# Altium project PCB_Project1.PrjPCB
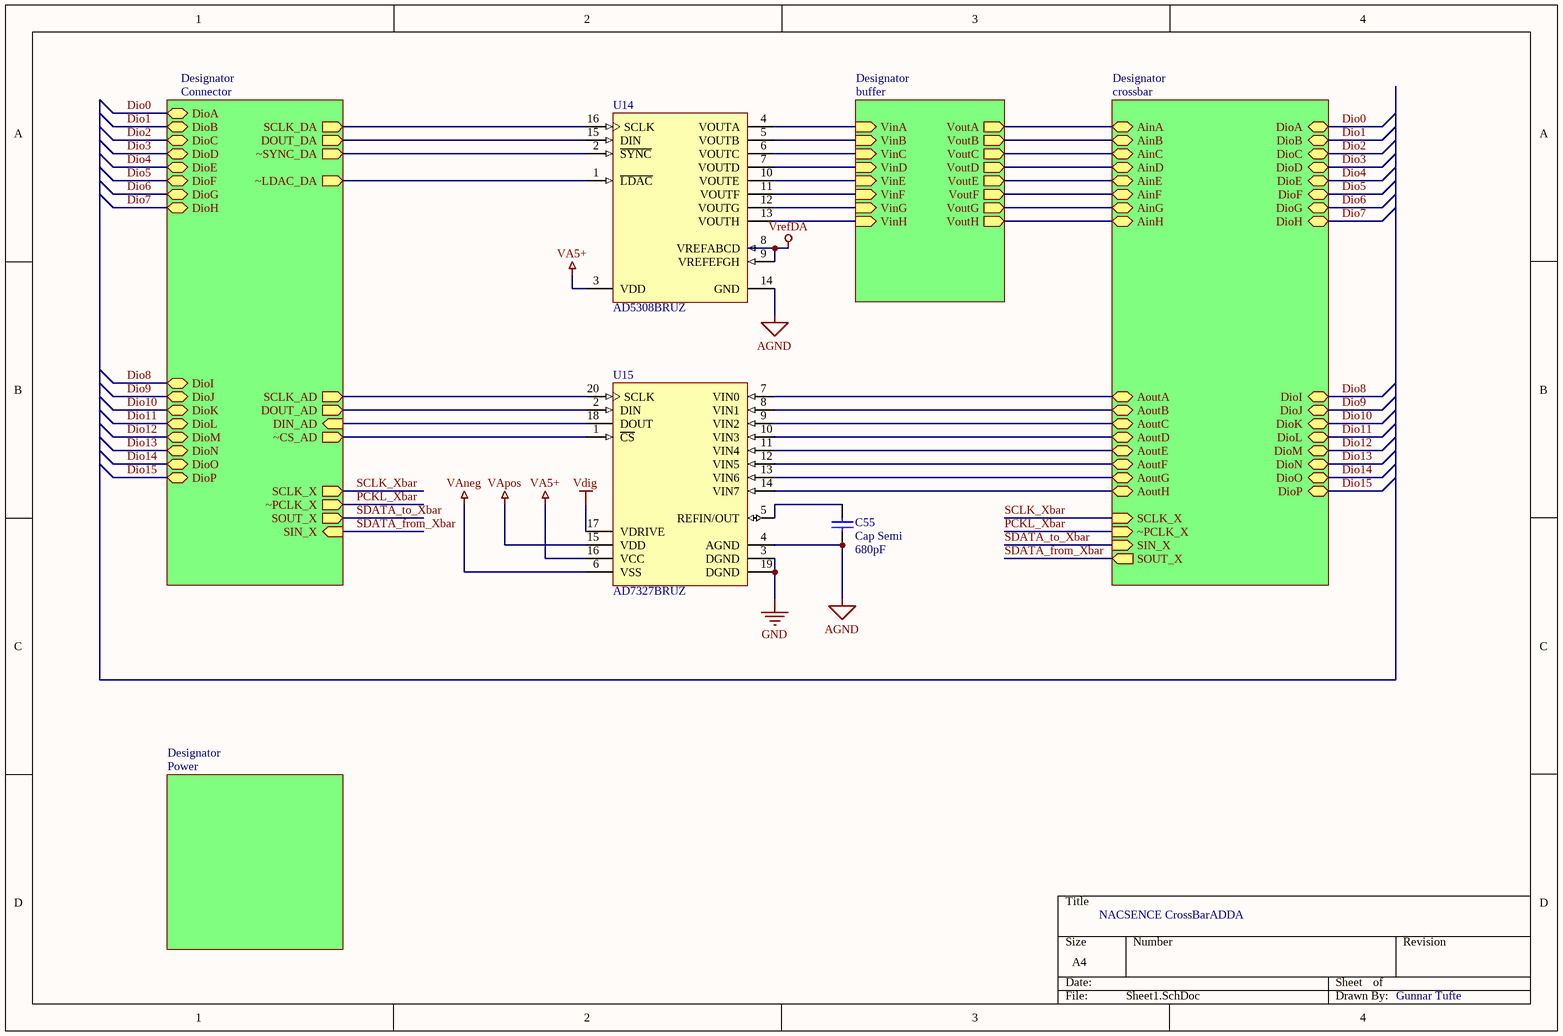
[diagram p0: Sheet1.SchDoc]
5 sheets, 117 parts. Net scope: hierarchical (ports join the sheet entries above them; power ports are global).
Board file: crossBarAdDaPCB1.PcbDoc
Sheets:
  Sheet1.SchDoc
    Designator = buffer.SchDoc
    Designator = crossbar.SchDoc
    Designator = Connector.SchDoc
    Designator = Power.SchDoc

## Sheet Sheet1.SchDoc
size A4

### Parts
C55  Cap Semi  value 680pF  [C1206]
U14  AD5308BRUZ  [RU-16_N]
U15  AD7327BRUZ  [RU-20_N]

### Sub-sheets
Designator = buffer: VinA (in), VinB (in), VinC (in), VinD (in), VinE (in), VinF (in), VinG (in), VinH (in), VoutA (out), VoutB (out), VoutC (out), VoutD (out), VoutE (out), VoutF (out), VoutG (out), VoutH (out)
Designator = crossbar: AinA, AinB, AinD, AinC, AinE, AinF, AinG, AinH, AoutA, AoutB, AoutD, AoutC, AoutE, AoutF, AoutG, AoutH, DioA, DioB, DioC, DioD, DioE, DioG, DioF, DioH, DioI, DioJ, DioK, DioL, DioM, DioN, DioO, DioP, SOUT_X (out), SIN_X (in), ~PCLK_X (in), SCLK_X (in)
Designator = Connector: SCLK_DA (out), DOUT_DA (out), ~SYNC_DA (out), ~LDAC_DA (out), SCLK_AD (out), DOUT_AD (out), DIN_AD (in), ~CS_AD (out), SCLK_X (out), ~PCLK_X (out), SOUT_X (out), SIN_X (in), DioA, DioB, DioC, DioD, DioE, DioG, DioF, DioH, DioI, DioJ, DioK, DioL, DioM, DioN, DioO, DioP
Designator = Power: no entries

### Nets
AGND: C55.2 U14.14(GND) U15.4(AGND)
GND: U15.3(DGND) U15.19(DGND)
VA5+: U14.3(VDD) U15.16(VCC)
VAneg: U15.6(VSS)
VApos: U15.15(VDD)
Vdig: U15.17(VDRIVE)
VrefDA: U14.8(VREFABCD) U14.9(VREFEFGH)
Dio0: sheet Designator/DioA, sheet Designator/DioA
Dio1: sheet Designator/DioB, sheet Designator/DioB
Dio2: sheet Designator/DioC, sheet Designator/DioC
Dio3: sheet Designator/DioD, sheet Designator/DioD
Dio4: sheet Designator/DioE, sheet Designator/DioE
Dio5: sheet Designator/DioF, sheet Designator/DioF
Dio6: sheet Designator/DioG, sheet Designator/DioG
Dio7: sheet Designator/DioH, sheet Designator/DioH
Dio8: sheet Designator/DioI, sheet Designator/DioI
Dio9: sheet Designator/DioJ, sheet Designator/DioJ
Dio10: sheet Designator/DioK, sheet Designator/DioK
Dio11: sheet Designator/DioL, sheet Designator/DioL
Dio12: sheet Designator/DioM, sheet Designator/DioM
Dio13: sheet Designator/DioN, sheet Designator/DioN
Dio14: sheet Designator/DioO, sheet Designator/DioO
Dio15: sheet Designator/DioP, sheet Designator/DioP
PCKL_Xbar: sheet Designator/~PCLK_X, sheet Designator/~PCLK_X
SCLK_Xbar: sheet Designator/SCLK_X, sheet Designator/SCLK_X
SDATA_from_Xbar: sheet Designator/SOUT_X, sheet Designator/SIN_X
SDATA_to_Xbar: sheet Designator/SIN_X, sheet Designator/SOUT_X
Net*1_15: sheet Designator/VoutA, sheet Designator/AinA
Net*1_16: sheet Designator/VoutB, sheet Designator/AinB
Net*1_17: sheet Designator/VoutC, sheet Designator/AinC
Net*1_18: sheet Designator/VoutD, sheet Designator/AinD
Net*1_19: sheet Designator/VoutE, sheet Designator/AinE
Net*1_20: sheet Designator/VoutF, sheet Designator/AinF
Net*1_21: sheet Designator/VoutG, sheet Designator/AinG
Net*1_22: sheet Designator/VoutH, sheet Designator/AinH
Net*1_23: U15.7(VIN0) ; sheet Designator/AoutA
Net*1_24: U15.8(VIN1) ; sheet Designator/AoutB
Net*1_25: U15.9(VIN2) ; sheet Designator/AoutC
Net*1_26: U15.10(VIN3) ; sheet Designator/AoutD
Net*1_27: U15.11(VIN4) ; sheet Designator/AoutE
Net*1_28: U15.12(VIN5) ; sheet Designator/AoutF
Net*1_29: U15.13(VIN6) ; sheet Designator/AoutG
Net*1_30: U15.14(VIN7) ; sheet Designator/AoutH
NetC55_1: C55.1 U15.5(REFIN/OUT)
NetP2_2: U14.15(DIN) ; sheet Designator/DOUT_DA
NetP4_2: U14.2(~{SYNC}) ; sheet Designator/~SYNC_DA
NetP6_2: U14.1(~{LDAC}) ; sheet Designator/~LDAC_DA
NetP7_2: U15.2(DIN) ; sheet Designator/DOUT_AD
NetP8_2: U15.18(DOUT) ; sheet Designator/DIN_AD
NetP9_2: U15.1(~{CS}) ; sheet Designator/~CS_AD
NetPnorth1_2: U14.16(SCLK) ; sheet Designator/SCLK_DA
NetPnorth1_4: U15.20(SCLK) ; sheet Designator/SCLK_AD
NetU1_3: U14.4(VOUTA) ; sheet Designator/VinA
NetU2_3: U14.10(VOUTE) ; sheet Designator/VinE
NetU3_3: U14.5(VOUTB) ; sheet Designator/VinB
NetU4_3: U14.11(VOUTF) ; sheet Designator/VinF
NetU5_3: U14.6(VOUTC) ; sheet Designator/VinC
NetU6_3: U14.12(VOUTG) ; sheet Designator/VinG
NetU7_3: U14.7(VOUTD) ; sheet Designator/VinD
NetU8_3: U14.13(VOUTH) ; sheet Designator/VinH

### Notes on the sheet
- NACSENCE CrossBarADDA
- Gunnar Tufte

### Library data of the parts
C55 = Cap Semi: Capacitor (Semiconductor SIM Model); Published: 8-Jun-2000; LatestRevisionDate: 29-May-2009; LatestRevisionNote: IPC-7351 Footprint Added.; PackageReference: C1206; Publisher: Altium Limited; PackageDescription: Chip Capacitor
U14 = AD5308BRUZ: Octal 8-Bit Voltage Output Digital-to-Analog Converter, 2.5 to 5.5 V, -40 to +125 degC, RU-16, Pb-Free, Tube; ADI Part Number: AD5308; Manufacturer: Analog Devices; # DAC Outputs: 8; Max V+: 5.5V; Op Pwr Diss: 5mW; Settling Time: 6µs; Single Supply: Yes; DatasheetVersion: Rev.F; PackageVersion: Nov-2002; PackageReference: RU-16; PackageDescription: 16-Lead Thin Shrink Small Outline Package [TSSOP]; Packing: Tube; Resolution (Bits): 8; RoHS: Y; Mounting Technology: Surface Mount; Code_JEDEC: MO-153-AB; ComponentLink1Description: Manufacturer URL; ComponentLink1URL: http://www.analog.com/en/index.html; ComponentLink2Description: Datasheet; ComponentLink2URL: http://www.analog.com/static/imported-files/data_sheets/AD5308_5318_5328.pdf; ComponentLink3Description: Package Specification; ComponentLink3URL: http://www.analog.com/static/imported-files/packages/36244347913743854010197452789RU16.pdf; ComponentLink4Description: URL Link1; ComponentLink4URL: Product URL:http://www.analog.com/en/digital-to-analog-converters/da-converters/ad5308/products/product.html
U15 = AD7327BRUZ: Octal 12-Bit True Bipolar Input Plus Sign Analog-to-Digital Converter with Serial, SPI Interface, Software-Selectable, 500KSPS, -40 to +85 degC, RU-20, Pb-Free, Tube; Part Number: AD7327; Manufacturer: Analog Devices; Resolution (Bits): 13; Channels: 8; Throughput Rate (SPS): 500K; Interface: Ser, SPI; DatasheetVersion: Rev.A; PackageVersion: 2000; PackageReference: RU-20; PackageDescription: 20-Lead Thin Shrink Small Outline Package [TSSOP]; RoHS: Y; Packing: Tube; Mounting Technology: Surface Mount; Code_JEDEC: MO-153AC; ComponentLink1Description: Manufacturer URL; ComponentLink1URL: http://www.analog.com/en/index.html; ComponentLink2Description: Datasheet; ComponentLink2URL: http://www.analog.com/static/imported-files/data_sheets/AD7327.pdf; ComponentLink3Description: Package Specification; ComponentLink3URL: http://www.analog.com/static/imported-files/packages/364515793657813558433715854054607941441RU20.pdf; ComponentLink4Description: Product URL; ComponentLink4URL: http://www.analog.com/en/analog-to-digital-converters/ad-converters/ad7327/products/product.html

## Sheet buffer.SchDoc
size A4
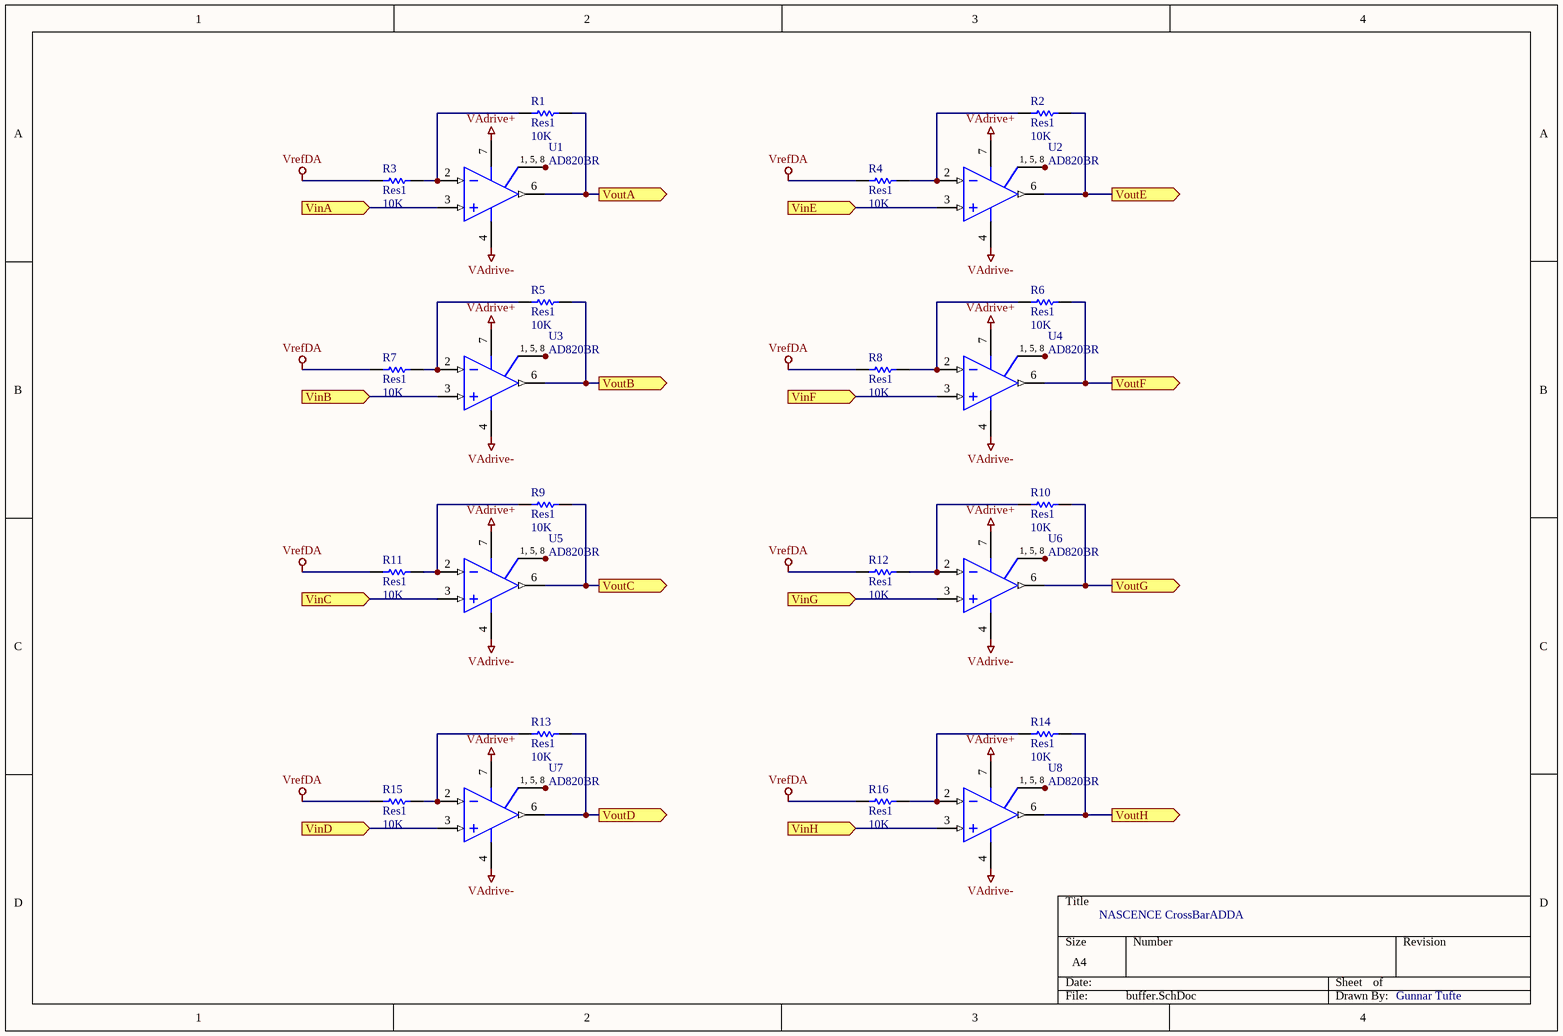
[diagram p1: buffer.SchDoc]

### Parts
R1  Res1  value 10K  [AXIAL-0.3]
R2  Res1  value 10K  [AXIAL-0.3]
R3  Res1  value 10K  [AXIAL-0.3]
R4  Res1  value 10K  [AXIAL-0.3]
R5  Res1  value 10K  [AXIAL-0.3]
R6  Res1  value 10K  [AXIAL-0.3]
R7  Res1  value 10K  [AXIAL-0.3]
R8  Res1  value 10K  [AXIAL-0.3]
R9  Res1  value 10K  [AXIAL-0.3]
R10  Res1  value 10K  [AXIAL-0.3]
R11  Res1  value 10K  [AXIAL-0.3]
R12  Res1  value 10K  [AXIAL-0.3]
R13  Res1  value 10K  [AXIAL-0.3]
R14  Res1  value 10K  [AXIAL-0.3]
R15  Res1  value 10K  [AXIAL-0.3]
R16  Res1  value 10K  [AXIAL-0.3]
U1  AD820BR  [R-8D_N]
U2  AD820BR  [R-8D_N]
U3  AD820BR  [R-8D_N]
U4  AD820BR  [R-8D_N]
U5  AD820BR  [R-8D_N]
U6  AD820BR  [R-8D_N]
U7  AD820BR  [R-8D_N]
U8  AD820BR  [R-8D_N]

### Ports
VinA (in), VinB (in), VinC (in), VinD (in), VinE (in), VinF (in), VinG (in), VinH (in), VoutA (out), VoutB (out), VoutC (out), VoutD (out), VoutE (out), VoutF (out), VoutG (out), VoutH (out)

### Nets
VAdrive+: U1.7(V+) U2.7(V+) U3.7(V+) U4.7(V+) U5.7(V+) U6.7(V+) U7.7(V+) U8.7(V+)
VAdrive-: U1.4(V-) U2.4(V-) U3.4(V-) U4.4(V-) U5.4(V-) U6.4(V-) U7.4(V-) U8.4(V-)
VrefDA: R3.1 R4.1 R7.1 R8.1 R11.1 R12.1 R15.1 R16.1
Net*1_15: R1.2 U1.6(OUT) ; port VoutA
Net*1_16: R5.2 U3.6(OUT) ; port VoutB
Net*1_17: R9.2 U5.6(OUT) ; port VoutC
Net*1_18: R13.2 U7.6(OUT) ; port VoutD
Net*1_19: R2.2 U2.6(OUT) ; port VoutE
Net*1_20: R6.2 U4.6(OUT) ; port VoutF
Net*1_21: R10.2 U6.6(OUT) ; port VoutG
Net*1_22: R14.2 U8.6(OUT) ; port VoutH
NetR1_1: R1.1 R3.2 U1.2(IN-)
NetR2_1: R2.1 R4.2 U2.2(IN-)
NetR5_1: R5.1 R7.2 U3.2(IN-)
NetR6_1: R6.1 R8.2 U4.2(IN-)
NetR9_1: R9.1 R11.2 U5.2(IN-)
NetR10_1: R10.1 R12.2 U6.2(IN-)
NetR13_1: R13.1 R15.2 U7.2(IN-)
NetR14_1: R14.1 R16.2 U8.2(IN-)
NetU1_1: U1.1(NC) U1.5(NC) U1.8(NC)
NetU1_3: U1.3(IN+) ; port VinA
NetU2_1: U2.1(NC) U2.5(NC) U2.8(NC)
NetU2_3: U2.3(IN+) ; port VinE
NetU3_1: U3.1(NC) U3.5(NC) U3.8(NC)
NetU3_3: U3.3(IN+) ; port VinB
NetU4_1: U4.1(NC) U4.5(NC) U4.8(NC)
NetU4_3: U4.3(IN+) ; port VinF
NetU5_1: U5.1(NC) U5.5(NC) U5.8(NC)
NetU5_3: U5.3(IN+) ; port VinC
NetU6_1: U6.1(NC) U6.5(NC) U6.8(NC)
NetU6_3: U6.3(IN+) ; port VinG
NetU7_1: U7.1(NC) U7.5(NC) U7.8(NC)
NetU7_3: U7.3(IN+) ; port VinD
NetU8_1: U8.1(NC) U8.5(NC) U8.8(NC)
NetU8_3: U8.3(IN+) ; port VinH

### Notes on the sheet
- NASCENCE CrossBarADDA
- Gunnar Tufte
- (in symbol AD820BR) 1, 5, 8

### Library data of the parts
R1-R16 = Res1: Resistor; Published: 8-Jun-2000; LatestRevisionDate: 17-Jul-2002; LatestRevisionNote: Re-released for DXP Platform.; PackageReference: AXIAL-0.3; Publisher: Altium Limited; PackageDescription: Axial Device, Thru-Hole; 2 Leads; 0.3 in Pin Spacing
U1-U8 = AD820BR: Single-Supply, Rail-to-Rail Low-Power FET-Input Operational Amplifier; Note: Pins 1, 5 and 8 are not connected.; Published: 8-Jun-2000; LatestRevisionDate: 13-Apr-2006; LatestRevisionNote: IPC-7351 Footprint Added.; DatasheetVersion: REV. A; PackageVersion: 1998; PackageReference: R-8D; Publisher: Altium Limited; PackageDescription: 8-Pin Narrow Body Small Outline Integrated Circuit 1.27 mm Pitch; ComponentLink1Description: Manufacturer Link; ComponentLink1URL: http://www.analog.com/en/prod/0,,759_786_AD820%2C00.html; ComponentLink2Description: Datasheet; ComponentLink2URL: http://www.analog.com/UploadedFiles/Data_Sheets/446075391AD820_d.pdf

## Sheet crossbar.SchDoc: CrossBar AD/DA
size A4; CompanyName: NTNU; DrawnBy: Gunnar Tufte; ProjectName: NASCENCE
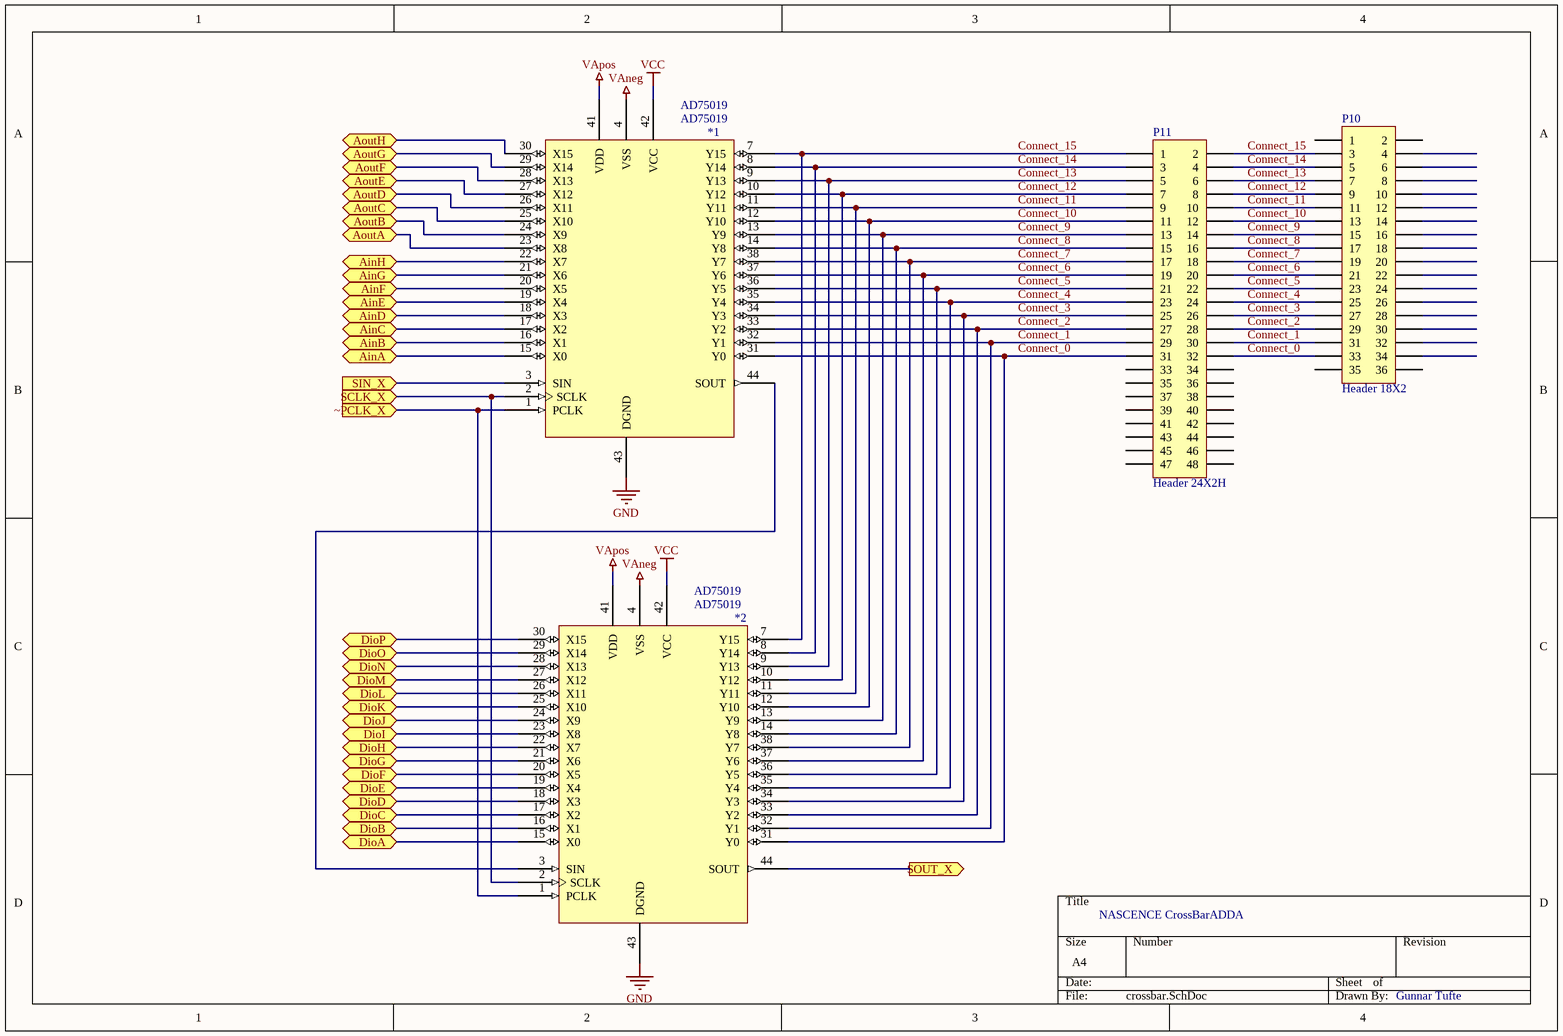
[diagram p2: crossbar.SchDoc]

### Parts
*1  AD75019  [PLCC-44AL]
*2  AD75019  [PLCC-44AL]
P10  Header 18X2  [HDR2X18]
P11  Header 24X2H  [HDR2X24H]

### Ports
AinA, AinB, AinC, AinD, AinE, AinF, AinG, AinH, AoutA, AoutB, AoutC, AoutD, AoutE, AoutF, AoutG, AoutH, DioA, DioB, DioC, DioD, DioE, DioF, DioG, DioH, DioI, DioJ, DioK, DioL, DioM, DioN, DioO, DioP, SCLK_X (in), SIN_X (in), SOUT_X (out), ~PCLK_X (in)

### Nets
GND: *1.43(DGND) *2.43(DGND)
VAneg: *1.4(VSS) *2.4(VSS)
VApos: *1.41(VDD) *2.41(VDD)
VCC: *1.42(VCC) *2.42(VCC)
Connect_0: *1.31(Y0) *2.31(Y0) P10.33 P11.31 P11.32
Connect_1: *1.32(Y1) *2.32(Y1) P10.31 P11.29 P11.30
Connect_2: *1.33(Y2) *2.33(Y2) P10.29 P11.27 P11.28
Connect_3: *1.34(Y3) *2.34(Y3) P10.27 P11.25 P11.26
Connect_4: *1.35(Y4) *2.35(Y4) P10.25 P11.23 P11.24
Connect_5: *1.36(Y5) *2.36(Y5) P10.23 P11.21 P11.22
Connect_6: *1.37(Y6) *2.37(Y6) P10.21 P11.19 P11.20
Connect_7: *1.38(Y7) *2.38(Y7) P10.19 P11.17 P11.18
Connect_8: *1.14(Y8) *2.14(Y8) P10.17 P11.15 P11.16
Connect_9: *1.13(Y9) *2.13(Y9) P10.15 P11.13 P11.14
Connect_10: *1.12(Y10) *2.12(Y10) P10.13 P11.11 P11.12
Connect_11: *1.11(Y11) *2.11(Y11) P10.11 P11.9 P11.10
Connect_12: *1.10(Y12) *2.10(Y12) P10.9 P11.7 P11.8
Connect_13: *1.9(Y13) *2.9(Y13) P10.7 P11.5 P11.6
Connect_14: *1.8(Y14) *2.8(Y14) P10.5 P11.3 P11.4
Connect_15: *1.7(Y15) *2.7(Y15) P10.3 P11.1 P11.2
Dio0: *2.15(X0) ; port DioA
Dio1: *2.16(X1) ; port DioB
Dio2: *2.17(X2) ; port DioC
Dio3: *2.18(X3) ; port DioD
Dio4: *2.19(X4) ; port DioE
Dio5: *2.20(X5) ; port DioF
Dio6: *2.21(X6) ; port DioG
Dio7: *2.22(X7) ; port DioH
Dio8: *2.23(X8) ; port DioI
Dio9: *2.24(X9) ; port DioJ
Dio10: *2.25(X10) ; port DioK
Dio11: *2.26(X11) ; port DioL
Dio12: *2.27(X12) ; port DioM
Dio13: *2.28(X13) ; port DioN
Dio14: *2.29(X14) ; port DioO
Dio15: *2.30(X15) ; port DioP
PCKL_Xbar: *1.1(PCLK) *2.1(PCLK) ; port ~PCLK_X
SCLK_Xbar: *1.2(SCLK) *2.2(SCLK) ; port SCLK_X
SDATA_from_Xbar: *2.44(SOUT) ; port SOUT_X
SDATA_to_Xbar: *1.3(SIN) ; port SIN_X
Net*1_15: *1.15(X0) ; port AinA
Net*1_16: *1.16(X1) ; port AinB
Net*1_17: *1.17(X2) ; port AinC
Net*1_18: *1.18(X3) ; port AinD
Net*1_19: *1.19(X4) ; port AinE
Net*1_20: *1.20(X5) ; port AinF
Net*1_21: *1.21(X6) ; port AinG
Net*1_22: *1.22(X7) ; port AinH
Net*1_23: *1.23(X8) ; port AoutA
Net*1_24: *1.24(X9) ; port AoutB
Net*1_25: *1.25(X10) ; port AoutC
Net*1_26: *1.26(X11) ; port AoutD
Net*1_27: *1.27(X12) ; port AoutE
Net*1_28: *1.28(X13) ; port AoutF
Net*1_29: *1.29(X14) ; port AoutG
Net*1_30: *1.30(X15) ; port AoutH
Net*1_44: *1.44(SOUT) *2.3(SIN)

Not connected (* = marked no-connect by the designer): *1 5(NC1) 6(NC2) 39(NC3) 40(NC4); *2 5(NC1) 6(NC2) 39(NC3) 40(NC4); P10 1 2 4 6 8 10 12 14 16 18 20 22 24 26 28 30 32 34 35 36; P11 33 34 35 36 37 38 39 40 41 42 43 44 45 46 47 48

### Notes on the sheet
- NASCENCE CrossBarADDA
- Gunnar Tufte

### Library data of the parts
*1 *2 = Component_1: crosspoint 16x16
P10 = Header 18X2: Header, 18-Pin, Dual row; LatestRevisionDate: 17-Jul-2002; LatestRevisionNote: Re-released for DXP Platform.; Publisher: Altium Limited
P11 = Header 24X2H: Header, 24-Pin, Dual row, Right Angle; LatestRevisionDate: 17-Jul-2002; LatestRevisionNote: Re-released for DXP Platform.; Publisher: Altium Limited

## Sheet Connector.SchDoc
size A4
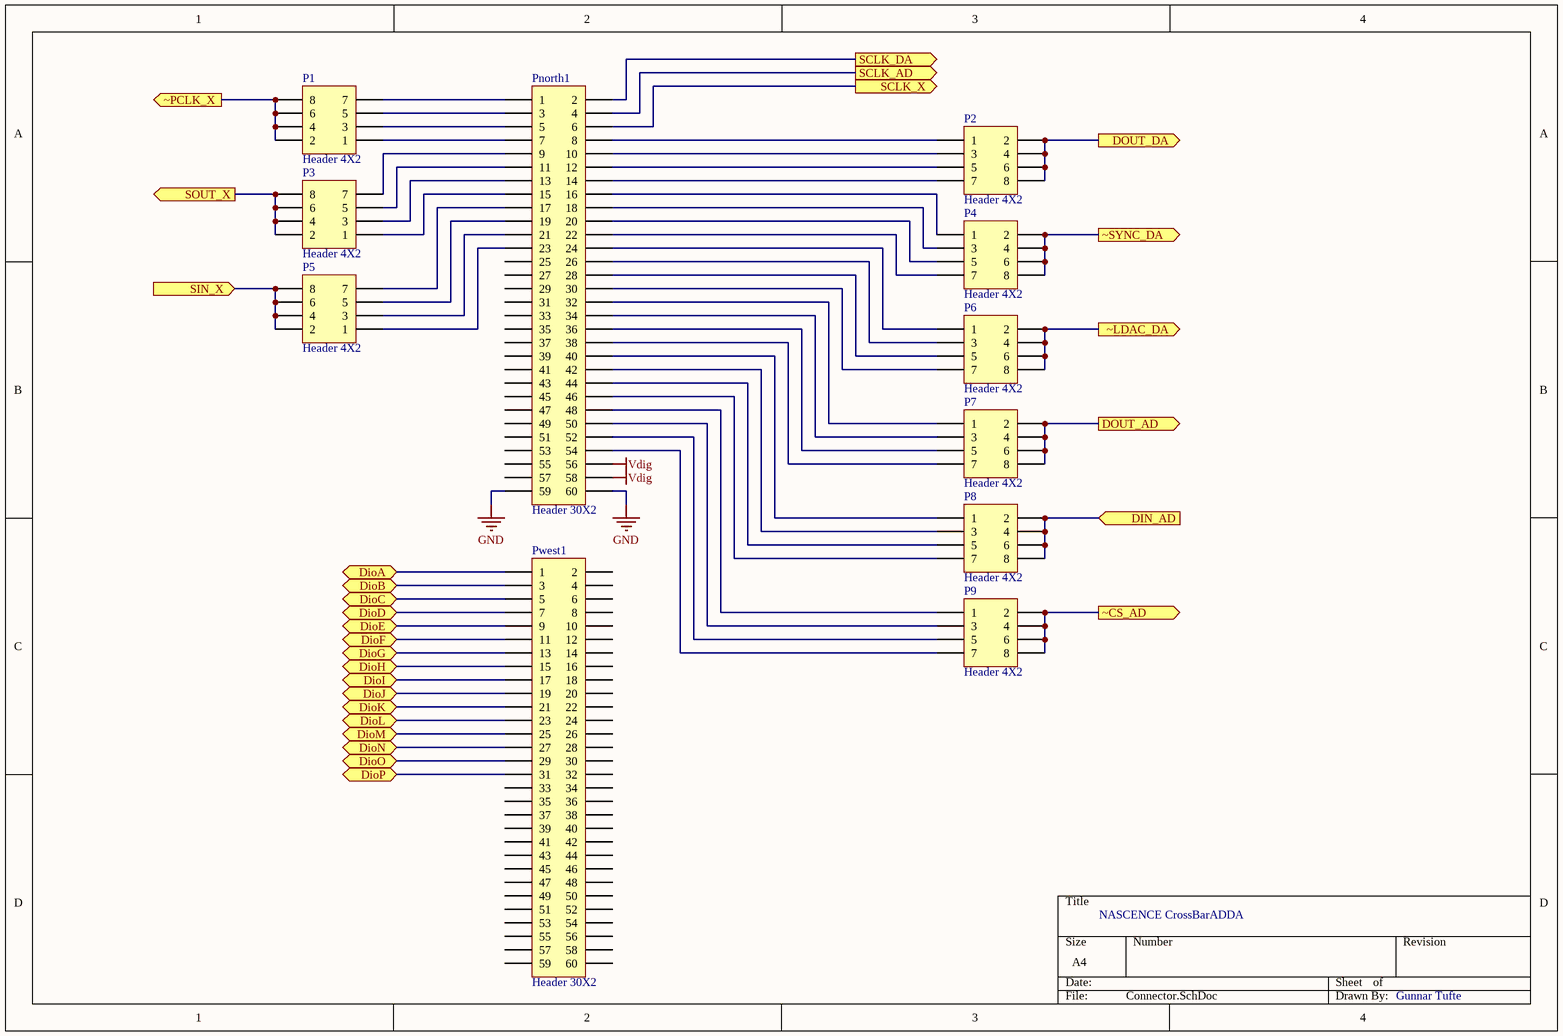
[diagram p3: Connector.SchDoc]

### Parts
P1  Header 4X2  [HDR2X4]
P2  Header 4X2  [HDR2X4]
P3  Header 4X2  [HDR2X4]
P4  Header 4X2  [HDR2X4]
P5  Header 4X2  [HDR2X4]
P6  Header 4X2  [HDR2X4]
P7  Header 4X2  [HDR2X4]
P8  Header 4X2  [HDR2X4]
P9  Header 4X2  [HDR2X4]
Pnorth1  Header 30X2  [HDR2X30]
Pwest1  Header 30X2  [HDR2X30]

### Ports
DIN_AD (in), DioA, DioB, DioC, DioD, DioE, DioF, DioG, DioH, DioI, DioJ, DioK, DioL, DioM, DioN, DioO, DioP, DOUT_AD (out), DOUT_DA (out), SCLK_AD (out), SCLK_DA (out), SCLK_X (out), SIN_X (in), SOUT_X (out), ~CS_AD (out), ~LDAC_DA (out), ~PCLK_X (out), ~SYNC_DA (out)

### Nets
GND: Pnorth1.59 Pnorth1.60
Vdig: Pnorth1.56 Pnorth1.58
Dio0: Pwest1.1 ; port DioA
Dio1: Pwest1.3 ; port DioB
Dio2: Pwest1.5 ; port DioC
Dio3: Pwest1.7 ; port DioD
Dio4: Pwest1.9 ; port DioE
Dio5: Pwest1.11 ; port DioF
Dio6: Pwest1.13 ; port DioG
Dio7: Pwest1.15 ; port DioH
Dio8: Pwest1.17 ; port DioI
Dio9: Pwest1.19 ; port DioJ
Dio10: Pwest1.21 ; port DioK
Dio11: Pwest1.23 ; port DioL
Dio12: Pwest1.25 ; port DioM
Dio13: Pwest1.27 ; port DioN
Dio14: Pwest1.29 ; port DioO
Dio15: Pwest1.31 ; port DioP
PCKL_Xbar: P1.2 P1.4 P1.6 P1.8 ; port ~PCLK_X
SCLK_Xbar: Pnorth1.6 ; port SCLK_X
SDATA_from_Xbar: P5.2 P5.4 P5.6 P5.8 ; port SIN_X
SDATA_to_Xbar: P3.2 P3.4 P3.6 P3.8 ; port SOUT_X
NetP1_1: P1.1 Pnorth1.7
NetP1_3: P1.3 Pnorth1.5
NetP1_5: P1.5 Pnorth1.3
NetP1_7: P1.7 Pnorth1.1
NetP2_1: P2.1 Pnorth1.8
NetP2_2: P2.2 P2.4 P2.6 P2.8 ; port DOUT_DA
NetP2_3: P2.3 Pnorth1.10
NetP2_5: P2.5 Pnorth1.12
NetP2_7: P2.7 Pnorth1.14
NetP3_1: P3.1 Pnorth1.15
NetP3_3: P3.3 Pnorth1.13
NetP3_5: P3.5 Pnorth1.11
NetP3_7: P3.7 Pnorth1.9
NetP4_1: P4.1 Pnorth1.16
NetP4_2: P4.2 P4.4 P4.6 P4.8 ; port ~SYNC_DA
NetP4_3: P4.3 Pnorth1.18
NetP4_5: P4.5 Pnorth1.20
NetP4_7: P4.7 Pnorth1.22
NetP5_1: P5.1 Pnorth1.23
NetP5_3: P5.3 Pnorth1.21
NetP5_5: P5.5 Pnorth1.19
NetP5_7: P5.7 Pnorth1.17
NetP6_1: P6.1 Pnorth1.24
NetP6_2: P6.2 P6.4 P6.6 P6.8 ; port ~LDAC_DA
NetP6_3: P6.3 Pnorth1.26
NetP6_5: P6.5 Pnorth1.28
NetP6_7: P6.7 Pnorth1.30
NetP7_1: P7.1 Pnorth1.32
NetP7_2: P7.2 P7.4 P7.6 P7.8 ; port DOUT_AD
NetP7_3: P7.3 Pnorth1.34
NetP7_5: P7.5 Pnorth1.36
NetP7_7: P7.7 Pnorth1.38
NetP8_1: P8.1 Pnorth1.40
NetP8_2: P8.2 P8.4 P8.6 P8.8 ; port DIN_AD
NetP8_3: P8.3 Pnorth1.42
NetP8_5: P8.5 Pnorth1.44
NetP8_7: P8.7 Pnorth1.46
NetP9_1: P9.1 Pnorth1.48
NetP9_2: P9.2 P9.4 P9.6 P9.8 ; port ~CS_AD
NetP9_3: P9.3 Pnorth1.50
NetP9_5: P9.5 Pnorth1.52
NetP9_7: P9.7 Pnorth1.54
NetPnorth1_2: Pnorth1.2 ; port SCLK_DA
NetPnorth1_4: Pnorth1.4 ; port SCLK_AD

Not connected (* = marked no-connect by the designer): Pnorth1 25 27 29 31 33 35 37 39 41 43 45 47 49 51 53 55 57; Pwest1 2 4 6 8 10 12 14 16 18 20 22 24 26 28 30 32 33 34 35 36 37 38 39 40 41 42 43 44 45 46 47 48 49 50 51 52 53 54 55 56 57 58 59 60

### Notes on the sheet
- NASCENCE CrossBarADDA
- Gunnar Tufte

### Library data of the parts
P1-P9 = Header 4X2: Header, 4-Pin, Dual row; LatestRevisionDate: 17-Jul-2002; LatestRevisionNote: Re-released for DXP Platform.; Publisher: Altium Limited
Pnorth1 Pwest1 = Header 30X2: Header, 30-Pin, Dual row; LatestRevisionDate: 17-Jul-2002; LatestRevisionNote: Re-released for DXP Platform.; Publisher: Altium Limited

## Sheet Power.SchDoc
size A4; CompanyName: NTNU; DrawnBy: GT
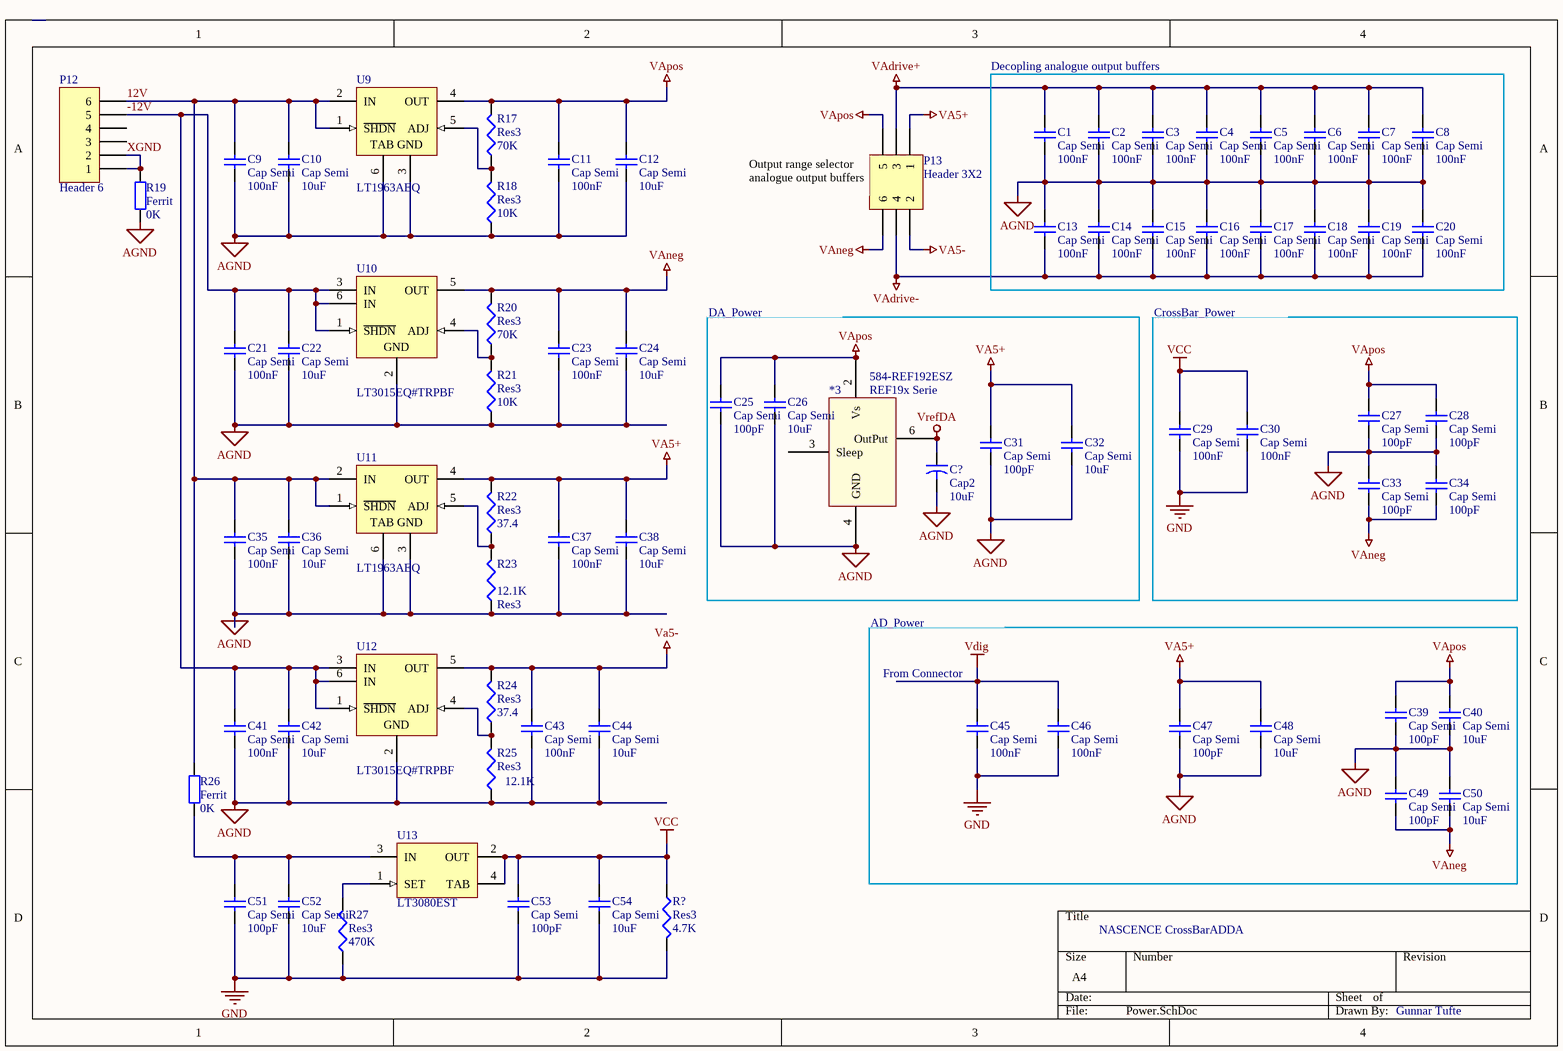
[diagram p4: Power.SchDoc]

### Parts
*3  REF19x Serie  Supplier Part Number 1: 584-REF192ESZ  [SOIC127P600-8M]
C1  Cap Semi  value 100nF  [C1206]
C2  Cap Semi  value 100nF  [C1206]
C3  Cap Semi  value 100nF  [C1206]
C4  Cap Semi  value 100nF  [C1206]
C5  Cap Semi  value 100nF  [C1206]
C6  Cap Semi  value 100nF  [C1206]
C7  Cap Semi  value 100nF  [C1206]
C8  Cap Semi  value 100nF  [C1206]
C9  Cap Semi  value 100nF  [C1206]
C10  Cap Semi  value 10uF  [C1206]
C11  Cap Semi  value 100nF  [C1206]
C12  Cap Semi  value 10uF  [C1206]
C13  Cap Semi  value 100nF  [C1206]
C14  Cap Semi  value 100nF  [C1206]
C15  Cap Semi  value 100nF  [C1206]
C16  Cap Semi  value 100nF  [C1206]
C17  Cap Semi  value 100nF  [C1206]
C18  Cap Semi  value 100nF  [C1206]
C19  Cap Semi  value 100nF  [C1206]
C20  Cap Semi  value 100nF  [C1206]
C21  Cap Semi  value 100nF  [C1206]
C22  Cap Semi  value 10uF  [C1206]
C23  Cap Semi  value 100nF  [C1206]
C24  Cap Semi  value 10uF  [C1206]
C25  Cap Semi  value 100pF  [C1206]
C26  Cap Semi  value 10uF  [C1206]
C27  Cap Semi  value 100pF  [C1206]
C28  Cap Semi  value 100pF  [C1206]
C29  Cap Semi  value 100nF  [C1206]
C30  Cap Semi  value 100nF  [C1206]
C31  Cap Semi  value 100pF  [C1206]
C32  Cap Semi  value 10uF  [C1206]
C33  Cap Semi  value 100pF  [C1206]
C34  Cap Semi  value 100pF  [C1206]
C35  Cap Semi  value 100nF  [C1206]
C36  Cap Semi  value 10uF  [C1206]
C37  Cap Semi  value 100nF  [C1206]
C38  Cap Semi  value 10uF  [C1206]
C39  Cap Semi  value 100pF  [C1206]
C40  Cap Semi  value 10uF  [C1206]
C41  Cap Semi  value 100nF  [C1206]
C42  Cap Semi  value 10uF  [C1206]
C43  Cap Semi  value 100nF  [C1206]
C44  Cap Semi  value 10uF  [C1206]
C45  Cap Semi  value 100nF  [C1206]
C46  Cap Semi  value 100nF  [C1206]
C47  Cap Semi  value 100pF  [C1206]
C48  Cap Semi  value 10uF  [C1206]
C49  Cap Semi  value 100pF  [C1206]
C50  Cap Semi  value 10uF  [C1206]
C51  Cap Semi  value 100pF  [C1206]
C52  Cap Semi  value 10uF  [C1206]
C53  Cap Semi  value 100pF  [C1206]
C54  Cap Semi  value 10uF  [C1206]
C?  Cap2  value 10uF  [CAPR5-4X5]
P12  Header 6  [HDR1X6]
P13  Header 3X2  [HDR2X3]
R17  Res3  value 70K  [14-1210]
R18  Res3  value 10K  [14-1210]
R19  Ferrit  value 0K  [AXIAL-0.4]
R20  Res3  value 70K  [14-1210]
R21  Res3  value 10K  [14-1210]
R22  Res3  value 37.4  [14-1210]
R23  Res3  value 12.1K  [14-1210]
R24  Res3  value 37.4  [14-1210]
R25  Res3  value 12.1K  [14-1210]
R26  Ferrit  value 0K  [AXIAL-0.4]
R27  Res3  value 470K  [14-1210]
R?  Res3  value 4.7K  [14-1210]
U9  LT1963AEQ  [LT-Q-5_N]
U10  LT3015EQ#TRPBF  [LT-Q-5_N]
U11  LT1963AEQ  [LT-Q-5_N]
U12  LT3015EQ#TRPBF  [LT-Q-5_N]
U13  LT3080EST  [LT-ST-3-SOT-223_N]

### Blocks framed on the sheet
Decopling analogue output buffers: C1-C8 C13-C20

### Nets
AGND: *3.4(GND) C1.2 C2.2 C3.1 C4.1 C5.1 C6.1 C7.1 C8.1 C9.1 C10.1 C11.1 C12.1 C13.2 C14.2 C15.2 C16.2 C17.2 C18.2 C19.2 C20.2 C21.1 C22.1 C23.1 C24.1 C25.1 C26.1 C27.1 C28.1 C31.1 C32.1 C33.2 C34.2 C35.1 C36.1 C37.1 C38.1 C39.1 C40.1 C41.1 C42.1 C43.1 C44.1 C47.2 C48.2 C49.2 C50.2 C?.2 R18.1 R19.1 R21.1 R23.1 R25.1 U9.3(GND) U9.6(TAB) U10.2(GND) U11.3(GND) U11.6(TAB) U12.2(GND)
GND: C29.1 C30.1 C45.1 C46.1 C51.2 C52.2 C53.2 C54.2 R27.1 R?.2
VA5+: C31.2 C32.2 C37.2 C38.2 C47.1 C48.1 P13.1 R22.2 U11.4(OUT)
VA5-: C43.2 C44.2 P13.2 R24.2 U12.5(OUT)
VAdrive+: C1.1 C2.1 C3.2 C4.2 C5.2 C6.2 C7.2 C8.2 P13.3
VAdrive-: C13.1 C14.1 C15.1 C16.1 C17.1 C18.1 C19.1 C20.1 P13.4
VAneg: C23.2 C24.2 C33.1 C34.1 C49.1 C50.1 P13.6 R20.2 U10.5(OUT)
VApos: *3.2(Vs) C11.2 C12.2 C25.2 C26.2 C27.2 C28.2 C39.2 C40.2 P13.5 R17.2 U9.4(OUT)
VCC: C29.2 C30.2 C53.1 C54.1 R?.1 U13.2(OUT) U13.4(TAB)
Vdig: C45.2 C46.2
VrefDA: *3.6(OutPut) C?.1
12V: C9.2 C10.2 C35.2 C36.2 P12.6 R26.2 U9.1(~{SHDN}) U9.2(IN) U11.1(~{SHDN}) U11.2(IN)
-12V: C21.2 C22.2 C41.2 C42.2 P12.5 U10.1(~{SHDN}) U10.3(IN) U10.6(IN) U12.1(~{SHDN}) U12.3(IN) U12.6(IN)
XGND: P12.1 P12.2 R19.2
NetC51_1: C51.1 C52.1 R26.1 U13.3(IN)
NetR17_1: R17.1 R18.2 U9.5(ADJ)
NetR20_1: R20.1 R21.2 U10.4(ADJ)
NetR22_1: R22.1 R23.2 U11.5(ADJ)
NetR24_1: R24.1 R25.2 U12.4(ADJ)
NetR27_2: R27.2 U13.1(SET)

Not connected (* = marked no-connect by the designer): *3 1(TP) 3(Sleep) 5(TP) 7(NC) 8(NC); P12 3 4

### Notes on the sheet
- (near P13) Output range selector
  analogue output buffers
- DA_Power
- CrossBar_Power
- AD_Power
- (near C45) From Connector
- NASCENCE CrossBarADDA
- Gunnar Tufte

### Library data of the parts
C1-C54 = Cap Semi: Capacitor (Semiconductor SIM Model); Published: 8-Jun-2000; LatestRevisionDate: 29-May-2009; LatestRevisionNote: IPC-7351 Footprint Added.; PackageReference: C1206; Publisher: Altium Limited; PackageDescription: Chip Capacitor
C? = Cap2: Capacitor; Published: 23-Sep-2002; PackageReference: CAPR5-4X5; Publisher: Altium Limited; PackageDescription: Capacitor; 2 Leads
P12 = Header 6: Header, 6-Pin; LatestRevisionDate: 17-Jul-2002; LatestRevisionNote: Re-released for DXP Platform.; Publisher: Altium Limited
P13 = Header 3X2: Header, 3-Pin, Dual row; LatestRevisionDate: 17-Jul-2002; LatestRevisionNote: Re-released for DXP Platform.; Publisher: Altium Limited
R17 R18 R20-R25 R27 R? = Res3: Resistor; Published: 8-Jun-2000; LatestRevisionDate: 29-May-2009; LatestRevisionNote: IPC-7351 Footprint Added.; PackageReference: J1-0603; Publisher: Altium Limited; PackageDescription: Chip Resistor
R19 R26 = Res2: Resistor; Published: 8-Jun-2000; LatestRevisionDate: 17-Jul-2002; LatestRevisionNote: Re-released for DXP Platform.; PackageReference: AXIAL-0.4; Publisher: Altium Limited; PackageDescription: Axial Device, Thru-Hole; 2 Leads; 0.4 in Pin Spacing
U9 U11 = LT1963AEQ: 1.5 A, Low Noise, Fast Transient Response LDO Regulator, 2.1 to 20 V Vin, Adjustable Vout, 5-pin DPAK (Q-5), -40 to 125 degC; Manufacturer: Linear Technology; Discrete Pass Element: no; Dropout Voltage(V): 0.34; Iout(mA): 1500; Isupply(mA): 1; Noise(uV): 40; Output Voltage: Adj; PSRR(dB): 63; Shutdown Current(uA): 0.01; Vin Max(V): 20; Vin Min(V): 2.1; Vout Min(V): 1.21; DatasheetVersion: Rev. E; PackageVersion: Rev. F, 09/2011; PackageReference: Q-5; PackageDescription: 5-Pin Plastic DD Pak, Body 10.2235 x 8.89 mm, Pitch 1.702 mm; Supplier 1: Digi-Key; Supplier Part Number 1: LT1963AEQ-ND; Supplier 2: Newark; Supplier Part Number 2: 57M7427; Number of Outputs: 1; RoHS: FALSE; Vout Max(V): 20; Mounting Technology: Surface Mount; PartNumber: LT1963AEQ; ComponentLink1Description: Manufacturer URL; ComponentLink1URL: http://www.linear.com/; ComponentLink2Description: Datasheet; ComponentLink2URL: http://cds.linear.com/docs/en/datasheet/1963afe.pdf; ComponentLink3Description: Package Specification; ComponentLink3URL: http://cds.linear.com/docs/en/packaging/Q%20DD5%2005-08-1461%20Rev%20F.pdf
U10 U12 = LT3015EQ#TRPBF: 1.5 A, Low Noise, Negative Linear Regulator with Precision Current Limit, -1.8 to -30 V Vin, Adjustable Vout, 5-pin DPAK (Q-5), -40 to 125 degC, Pb-Free, Tape and Reel; Manufacturer: Linear Technology; Discrete Pass Element: no; Dropout Voltage(V): 0.31; Iout(mA): 1500; Isupply(mA): 1.1; Noise(uV): 60; Number of Outputs: 1; Output Voltage: Adj; PSRR(dB): 65; Shutdown Current(uA): 17; Vout Max(V): -1.22; Vout Min(V): -29.3; DatasheetVersion: Rev. B; PackageVersion: Rev. F, 09/2011; PackageReference: Q-5; PackageDescription: 5-Pin Plastic DD Pak, Body 10.2235 x 8.89 mm, Pitch 1.702 mm; Supplier 1: Digi-Key; Supplier Part Number 1: LT3015EQ#TRPBF-ND; Supplier 2: Newark; Supplier Part Number 2: 59T5799; Packing: Tape and Reel; RoHS: TRUE; Vin Max(V): -1.8; Vin Min(V): -30; Mounting Technology: Surface Mount; PartNumber: LT3015EQ#TRPBF; ComponentLink1Description: Manufacturer URL; ComponentLink1URL: http://www.linear.com/; ComponentLink2Description: Datasheet; ComponentLink2URL: http://cds.linear.com/docs/en/datasheet/3015fb.pdf; ComponentLink3Description: Package Specification; ComponentLink3URL: http://cds.linear.com/docs/en/packaging/Q%20DD5%2005-08-1461%20Rev%20F.pdf
U13 = LT3080EST: Adjustable 1.1 A Single Resistor Low Dropout Regulator, 0.3 mA Isupply, 3-pin SOT223 (ST-3), -40 to 125 degC; Manufacturer: Linear Technology; Extended Temp: E, I; Initial Accuracy(%): 1; Isupply(mA): 0.3; Vin Max(V): 36; Vin Min(V): 1.2; DatasheetVersion: Rev. F; PackageVersion: Jun-10; PackageReference: ST-3; PackageDescription: 3-Pin Plastic SOT-223, Body 3.505 x 6.505 mm, Pitch 2.3 mm; RoHS: FALSE; Mounting Technology: Surface Mount; PartNumber: LT3080EST; ComponentLink1Description: Manufacturer URL; ComponentLink1URL: http://www.linear.com/; ComponentLink2Description: Datasheet; ComponentLink2URL: http://cds.linear.com/docs/en/datasheet/3080fc.pdf; ComponentLink3Description: Package Specification; ComponentLink3URL: http://cds.linear.com/docs/en/packaging/SOT_3_05-08-1630.pdf
*3 = REF19x Serie: Supplier 1: Mouser

## Nets that join several sheets
AGND: Sheet1 (C55.2 U14.14 U15.4), Power (59 pins)
GND: Sheet1 (U15.3 U15.19), crossbar (*1.43 *2.43), Connector (Pnorth1.59 Pnorth1.60), Power (10 pins)
VA5+: Sheet1 (U14.3 U15.16), Power (9 pins)
VAdrive+: buffer (8 pins), Power (9 pins)
VAdrive-: buffer (8 pins), Power (9 pins)
VAneg: Sheet1 (U15.6), crossbar (*1.4 *2.4), Power (9 pins)
VApos: Sheet1 (U15.15), crossbar (*1.41 *2.41), Power (12 pins)
VCC: crossbar (*1.42 *2.42), Power (7 pins)
Vdig: Sheet1 (U15.17), Connector (Pnorth1.56 Pnorth1.58), Power (C45.2 C46.2)
VrefDA: Sheet1 (U14.8 U14.9), buffer (8 pins), Power (*3.6 C?.1)
Dio0: crossbar (*2.15), Connector (Pwest1.1)
Dio1: crossbar (*2.16), Connector (Pwest1.3)
Dio2: crossbar (*2.17), Connector (Pwest1.5)
Dio3: crossbar (*2.18), Connector (Pwest1.7)
Dio4: crossbar (*2.19), Connector (Pwest1.9)
Dio5: crossbar (*2.20), Connector (Pwest1.11)
Dio6: crossbar (*2.21), Connector (Pwest1.13)
Dio7: crossbar (*2.22), Connector (Pwest1.15)
Dio8: crossbar (*2.23), Connector (Pwest1.17)
Dio9: crossbar (*2.24), Connector (Pwest1.19)
Dio10: crossbar (*2.25), Connector (Pwest1.21)
Dio11: crossbar (*2.26), Connector (Pwest1.23)
Dio12: crossbar (*2.27), Connector (Pwest1.25)
Dio13: crossbar (*2.28), Connector (Pwest1.27)
Dio14: crossbar (*2.29), Connector (Pwest1.29)
Dio15: crossbar (*2.30), Connector (Pwest1.31)
Net*1_15: buffer (R1.2 U1.6), crossbar (*1.15)
Net*1_16: buffer (R5.2 U3.6), crossbar (*1.16)
Net*1_17: buffer (R9.2 U5.6), crossbar (*1.17)
Net*1_18: buffer (R13.2 U7.6), crossbar (*1.18)
Net*1_19: buffer (R2.2 U2.6), crossbar (*1.19)
Net*1_20: buffer (R6.2 U4.6), crossbar (*1.20)
Net*1_21: buffer (R10.2 U6.6), crossbar (*1.21)
Net*1_22: buffer (R14.2 U8.6), crossbar (*1.22)
Net*1_23: Sheet1 (U15.7), crossbar (*1.23)
Net*1_24: Sheet1 (U15.8), crossbar (*1.24)
Net*1_25: Sheet1 (U15.9), crossbar (*1.25)
Net*1_26: Sheet1 (U15.10), crossbar (*1.26)
Net*1_27: Sheet1 (U15.11), crossbar (*1.27)
Net*1_28: Sheet1 (U15.12), crossbar (*1.28)
Net*1_29: Sheet1 (U15.13), crossbar (*1.29)
Net*1_30: Sheet1 (U15.14), crossbar (*1.30)
NetP2_2: Sheet1 (U14.15), Connector (P2.2 P2.4 P2.6 P2.8)
NetP4_2: Sheet1 (U14.2), Connector (P4.2 P4.4 P4.6 P4.8)
NetP6_2: Sheet1 (U14.1), Connector (P6.2 P6.4 P6.6 P6.8)
NetP7_2: Sheet1 (U15.2), Connector (P7.2 P7.4 P7.6 P7.8)
NetP8_2: Sheet1 (U15.18), Connector (P8.2 P8.4 P8.6 P8.8)
NetP9_2: Sheet1 (U15.1), Connector (P9.2 P9.4 P9.6 P9.8)
NetPnorth1_2: Sheet1 (U14.16), Connector (Pnorth1.2)
NetPnorth1_4: Sheet1 (U15.20), Connector (Pnorth1.4)
NetU1_3: Sheet1 (U14.4), buffer (U1.3)
NetU2_3: Sheet1 (U14.10), buffer (U2.3)
NetU3_3: Sheet1 (U14.5), buffer (U3.3)
NetU4_3: Sheet1 (U14.11), buffer (U4.3)
NetU5_3: Sheet1 (U14.6), buffer (U5.3)
NetU6_3: Sheet1 (U14.12), buffer (U6.3)
NetU7_3: Sheet1 (U14.7), buffer (U7.3)
NetU8_3: Sheet1 (U14.13), buffer (U8.3)
PCKL_Xbar: crossbar (*1.1 *2.1), Connector (P1.2 P1.4 P1.6 P1.8)
SCLK_Xbar: crossbar (*1.2 *2.2), Connector (Pnorth1.6)
SDATA_from_Xbar: crossbar (*2.44), Connector (P5.2 P5.4 P5.6 P5.8)
SDATA_to_Xbar: crossbar (*1.3), Connector (P3.2 P3.4 P3.6 P3.8)